# EAGLE design LC_LightCanvas_Rev_1 (EAGLE 7.6.0)
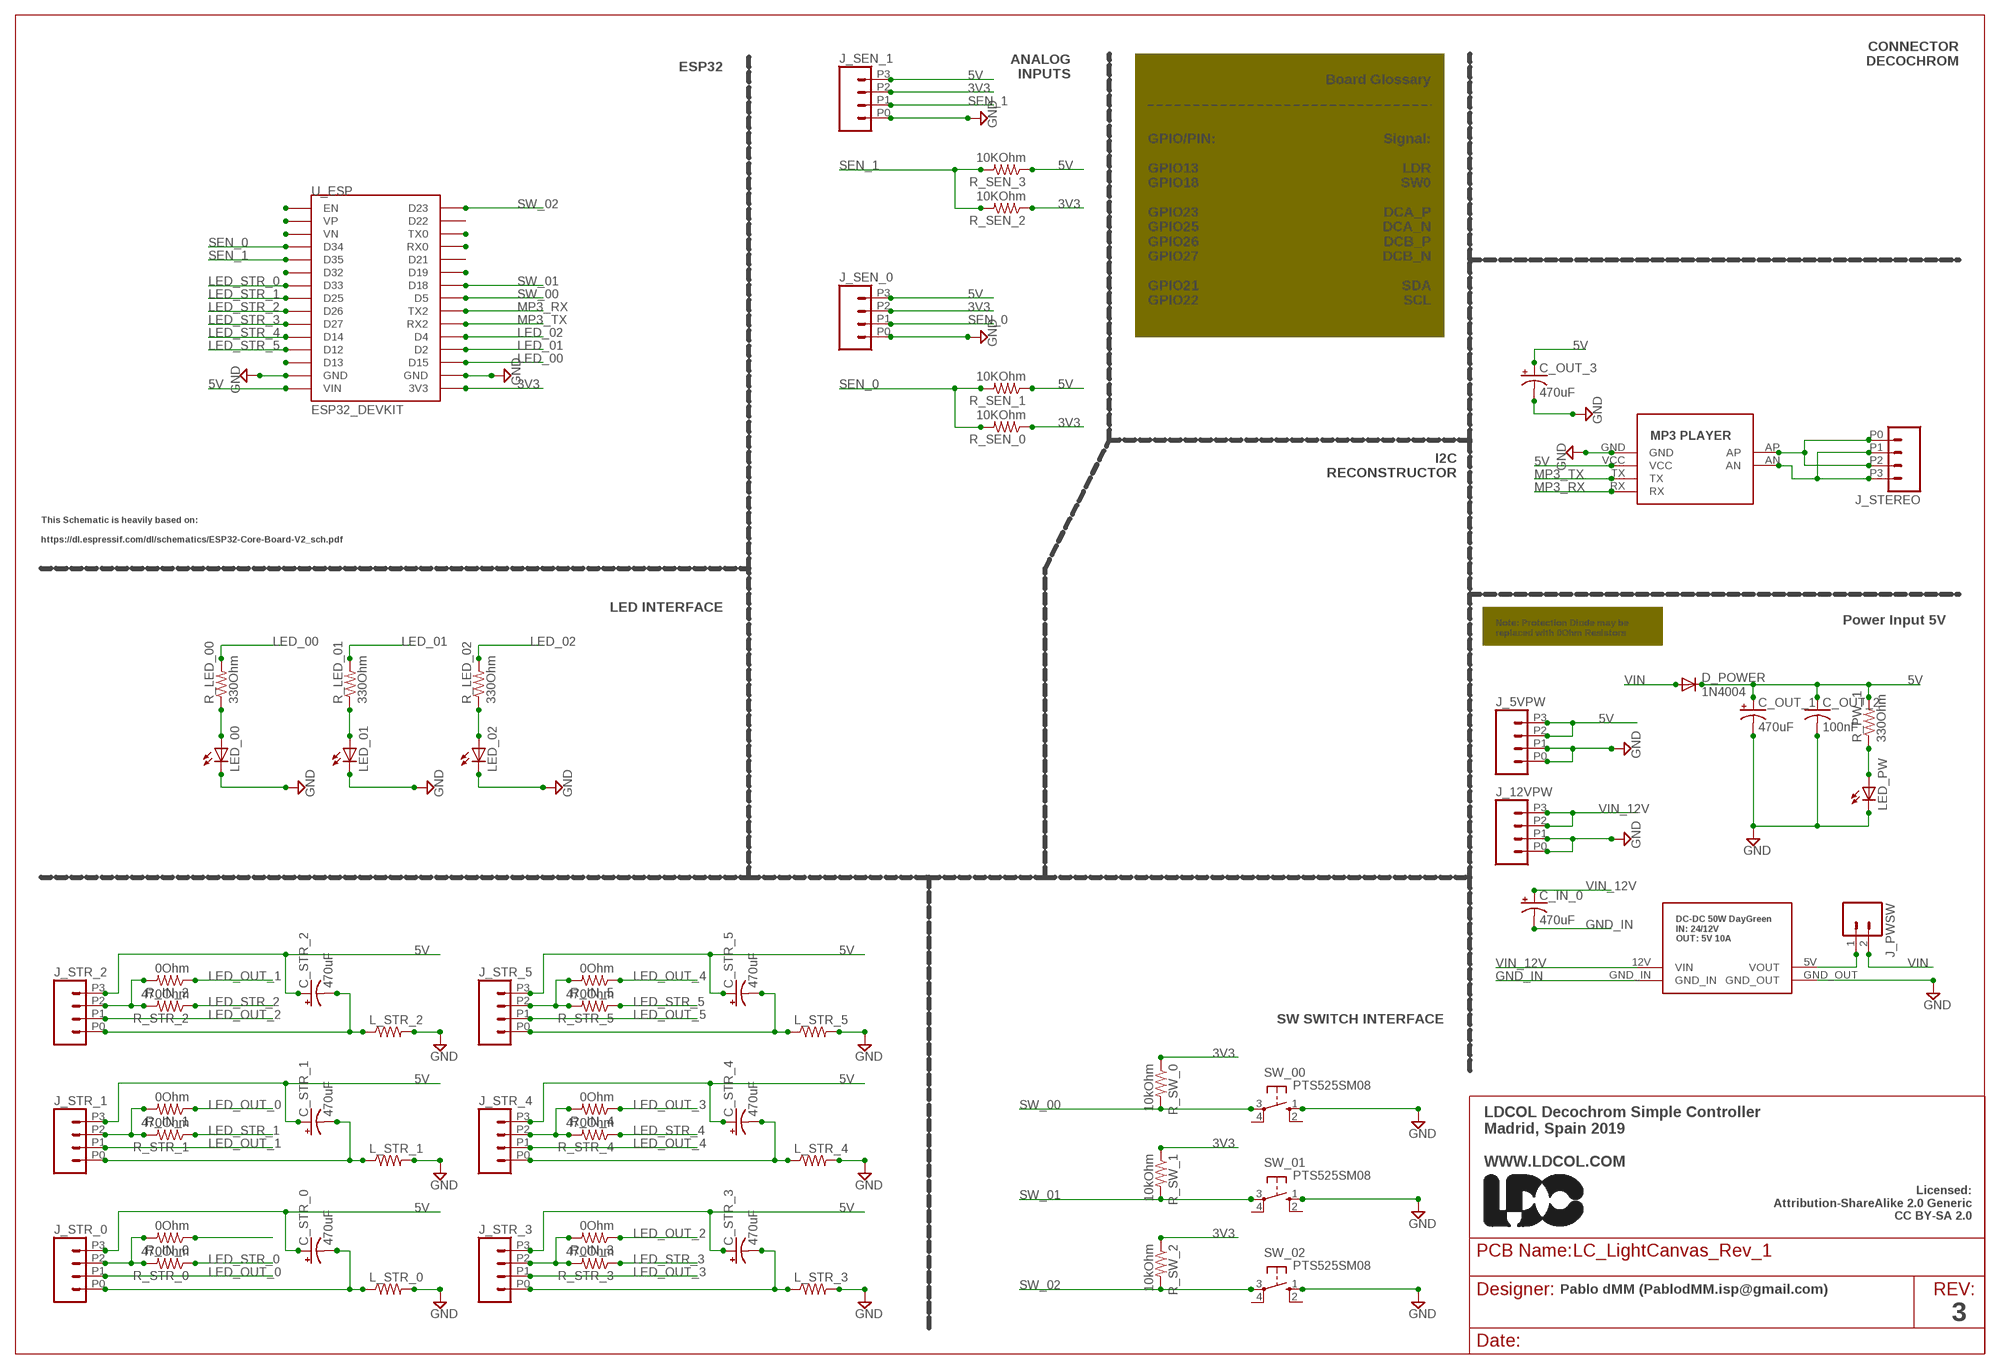
[diagram p0: schematic, sheet 1]

## Parts
C_IN_0  470uF  CPOL-USE5-10.5  [E5-10,5]
C_OUT_1  470uF  CPOL-USE5-10.5  [E5-10,5]
C_OUT_2  100nF  C-USC0805  [C0805]
C_OUT_3  470uF  CPOL-USE5-10.5  [E5-10,5]
C_STR_0  470uF  CPOL-USE5-10.5  [E5-10,5]
C_STR_1  470uF  CPOL-USE5-10.5  [E5-10,5]
C_STR_2  470uF  CPOL-USE5-10.5  [E5-10,5]
C_STR_3  470uF  CPOL-USE5-10.5  [E5-10,5]
C_STR_4  470uF  CPOL-USE5-10.5  [E5-10,5]
C_STR_5  470uF  CPOL-USE5-10.5  [E5-10,5]
D_POWER  1N4004  [DO41-10]
J_5VPW  M04  [1X04_2.54_SCREWTERM]
J_12VPW  M04  [1X04_2.54_SCREWTERM]
J_PWSW  M023.5MM-NO_SILK  [SCREWTERMINAL-3.5MM-2-NS]
J_SEN_0  M04  [1X04_2.54_SCREWTERM]
J_SEN_1  M04  [1X04_2.54_SCREWTERM]
J_STEREO  M04  [1X04_2.54_SCREWTERM]
J_STR_0  M04  [1X04_2.54_SCREWTERM]
J_STR_1  M04  [1X04_2.54_SCREWTERM]
J_STR_2  M04  [1X04_2.54_SCREWTERM]
J_STR_3  M04  [1X04_2.54_SCREWTERM]
J_STR_4  M04  [1X04_2.54_SCREWTERM]
J_STR_5  M04  [1X04_2.54_SCREWTERM]
L_STR_0  R-US_R2012  [R2012]
L_STR_1  R-US_R2012  [R2012]
L_STR_2  R-US_R2012  [R2012]
L_STR_3  R-US_R2012  [R2012]
L_STR_4  R-US_R2012  [R2012]
L_STR_5  R-US_R2012  [R2012]
LED_00  LEDCHIPLED_0805  [CHIPLED_0805]
LED_01  LEDCHIPLED_0805  [CHIPLED_0805]
LED_02  LEDCHIPLED_0805  [CHIPLED_0805]
LED_PW  LEDCHIPLED_0805  [CHIPLED_0805]
R_IN_0  0Ohm  R-US_M0805  [M0805]
R_IN_1  0Ohm  R-US_M0805  [M0805]
R_IN_2  0Ohm  R-US_M0805  [M0805]
R_IN_3  0Ohm  R-US_M0805  [M0805]
R_IN_4  0Ohm  R-US_M0805  [M0805]
R_IN_5  0Ohm  R-US_M0805  [M0805]
R_LED_00  330Ohm  R-US_M0805  [M0805]
R_LED_01  330Ohm  R-US_M0805  [M0805]
R_LED_02  330Ohm  R-US_M0805  [M0805]
R_PW_1  330Ohm  R-US_M0805  [M0805]
R_SEN_0  10KOhm  R-US_M1206  [M1206]
R_SEN_1  10KOhm  R-US_M1206  [M1206]
R_SEN_2  10KOhm  R-US_M1206  [M1206]
R_SEN_3  10KOhm  R-US_M1206  [M1206]
R_STR_0  470Ohm  R-US_M0805  [M0805]
R_STR_1  470Ohm  R-US_M0805  [M0805]
R_STR_2  470Ohm  R-US_M0805  [M0805]
R_STR_3  470Ohm  R-US_M0805  [M0805]
R_STR_4  470Ohm  R-US_M0805  [M0805]
R_STR_5  470Ohm  R-US_M0805  [M0805]
R_SW_0  10kOhm  R-US_M0805  [M0805]
R_SW_1  10kOhm  R-US_M0805  [M0805]
R_SW_2  10kOhm  R-US_M0805  [M0805]
SW_00  PTS525SM08  [SM08]
SW_01  PTS525SM08  [SM08]
SW_02  PTS525SM08  [SM08]
U$1  DC_CONVERTER  [DC_CONVERTER]
U$2  MP3_PLAYER  [MP3_PLAYER]
U_ESP  ESP32_DEVKIT  [ESP32_DEVKIT]

## Nets
3V3: J_SEN_0.P2 J_SEN_1.P2 R_SEN_0.1 R_SEN_2.1 R_SW_0.1 R_SW_1.1 R_SW_2.1 U_ESP.3V3
5V [GND]: C_OUT_1.+ C_OUT_2.1 C_OUT_3.+ C_STR_0.+ C_STR_1.+ C_STR_2.+ C_STR_3.+ C_STR_4.+ C_STR_5.+ D_POWER.C J_5VPW.P2 J_5VPW.P3 J_SEN_0.P3 J_SEN_1.P3 J_STR_0.P3 J_STR_1.P3 J_STR_2.P3 J_STR_3.P3 J_STR_4.P3 J_STR_5.P3 R_PW_1.2 R_SEN_1.1 R_SEN_3.1 U$2.VCC U_ESP.VIN
GND [GND]: C_OUT_1.- C_OUT_2.2 C_OUT_3.- J_5VPW.P0 J_5VPW.P1 J_12VPW.P0 J_12VPW.P1 J_SEN_0.P0 J_SEN_1.P0 L_STR_0.2 L_STR_1.2 L_STR_2.2 L_STR_3.2 L_STR_4.2 L_STR_5.2 LED_00.C LED_01.C LED_02.C LED_PW.C SW_00.1(S) SW_01.1(S) SW_02.1(S) U$1.GND_OUT U$2.GND U_ESP.GND@1(GND) U_ESP.GND@2(GND)
GND_IN: C_IN_0.- U$1.GND_IN
LED_00: R_LED_00.2 U_ESP.D15
LED_01: R_LED_01.2 U_ESP.D2
LED_02: R_LED_02.2 U_ESP.D4
LED_OUT_0: J_STR_0.P1 R_IN_1.1
LED_OUT_1: J_STR_1.P1 R_IN_2.1
LED_OUT_2: J_STR_2.P1 R_IN_3.1
LED_OUT_3: J_STR_3.P1 R_IN_4.1
LED_OUT_4: J_STR_4.P1 R_IN_5.1
LED_OUT_5: J_STR_5.P1
LED_STR_0: R_STR_0.1 U_ESP.D33
LED_STR_1: R_STR_1.1 U_ESP.D25
LED_STR_2: R_STR_2.1 U_ESP.D26
LED_STR_3: R_STR_3.1 U_ESP.D27
LED_STR_4: R_STR_4.1 U_ESP.D14
LED_STR_5: R_STR_5.1 U_ESP.D12
MP3_RX: U$2.RX U_ESP.TX2
MP3_TX: U$2.TX U_ESP.RX2
N$1: LED_01.A R_LED_01.1
N$2: LED_02.A R_LED_02.1
N$3: C_STR_0.- J_STR_0.P0 L_STR_0.1
N$4: R_IN_0.1
N$5: C_STR_1.- J_STR_1.P0 L_STR_1.1
N$6: J_STR_1.P2 R_IN_1.2 R_STR_1.2
N$7: U_ESP.D13
N$8: LED_00.A R_LED_00.1
N$9: J_PWSW.1 U$1.5V(VOUT)
N$10: LED_PW.A R_PW_1.1
N$11: J_STR_0.P2 R_IN_0.2 R_STR_0.2
N$12: U_ESP.D32
N$13: C_STR_3.- J_STR_3.P0 L_STR_3.1
N$14: U_ESP.D19
N$15: U_ESP.VN
N$16: U_ESP.VP
N$17: U_ESP.EN
N$18: U_ESP.TX0
N$19: U_ESP.RX0
N$20: C_STR_2.- J_STR_2.P0 L_STR_2.1
N$21: J_STR_2.P2 R_IN_2.2 R_STR_2.2
N$24: J_STR_3.P2 R_IN_3.2 R_STR_3.2
N$26: C_STR_4.- J_STR_4.P0 L_STR_4.1
N$27: J_STR_4.P2 R_IN_4.2 R_STR_4.2
N$28: C_STR_5.- J_STR_5.P0 L_STR_5.1
N$29: J_STR_5.P2 R_IN_5.2 R_STR_5.2
N$32: J_STEREO.P0 J_STEREO.P2 U$2.AP
N$33: J_STEREO.P1 J_STEREO.P3 U$2.AN
SEN_0: J_SEN_0.P1 R_SEN_0.2 R_SEN_1.2 U_ESP.D34
SEN_1: J_SEN_1.P1 R_SEN_2.2 R_SEN_3.2 U_ESP.D35
SW_00: R_SW_0.2 SW_00.3(P) U_ESP.D5
SW_01: R_SW_1.2 SW_01.3(P) U_ESP.D18
SW_02: R_SW_2.2 SW_02.3(P) U_ESP.D23
VIN: D_POWER.A J_PWSW.2
VIN_12V: C_IN_0.+ J_12VPW.P2 J_12VPW.P3 U$1.12V(VIN)
Unconnected: SW_00.2(S) SW_00.4(P) SW_01.2(S) SW_01.4(P) SW_02.2(S) SW_02.4(P) U_ESP.D21 U_ESP.D22

## Notes on the sheet
- CONNECTOR
  DECOCHROM
- ESP32
- ANALOG
  INPUTS
- Board Glossary
- GPIO/PIN:
  
  GPIO13
  GPIO18
  
  GPIO23
  GPIO25
  GPIO26
  GPIO27
  
  GPIO21
  GPIO22
- Signal:
  
  LDR
  SW0
  
  DCA_P
  DCA_N
  DCB_P
  DCB_N
  
  SDA
  SCL
- I2C
  RECONSTRUCTOR
- This Schematic is heavily based on:
  
  https://dl.espressif.com/dl/schematics/ESP32-Core-Board-V2_sch.pdf
- LED INTERFACE
- Note: Protection Diode may be
  replaced with 0Ohm Resistors
- Power Input 5V
- SW SWITCH INTERFACE
- LDCOL Decochrom Simple Controller
  Madrid, Spain 2019
  
  WWW.LDCOL.COM
- Licensed:
  Attribution-ShareAlike 2.0 Generic
  CC BY-SA 2.0
- Pablo dMM (PablodMM.isp@gmail.com)
- 3

## Library data of the parts
C_IN_0 C_OUT_1 C_OUT_3 C_STR_0 C_STR_1-C_STR_5 = adafruit:CPOL-US: POLARIZED CAPACITOR, American symbol
C_OUT_2 = adafruit:C-US: CAPACITOR, American symbol
D_POWER = adafruit:1N4004: DIODE General purpose 1N400x type rectifier (With bigger pads) http://www.ladyada.net/library/pcb/eaglelibrary.html
J_5VPW J_12VPW J_SEN_0 J_SEN_1 J_STEREO J_STR_0 J_STR_1-J_STR_5 = SparkFun-Connectors2:M04: Header 4 Standard 4-pin 0.1" header. Use with straight break away headers (SKU : PRT-00116), right angle break away headers (PRT-00553), swiss pins (PRT-00743), machine pins (PRT-00117), and female headers (PRT-00115). Molex polarized connector foot print use with SKU : PRT-08231 with associated crimp pins and housings. 1MM SMD Version SKU: PRT-10208
J_PWSW = SparkFun-Connectors:M02: Standard 2-pin 0.1" header. Use with - straight break away headers ( PRT-00116) - right angle break away headers (PRT-00553) - swiss pins (PRT-00743) - machine pins (PRT-00117) - female headers (PRT-00115) Molex polarized connector foot print use with: PRT-08233 with associated crimp pins and housings. 2.54_SCREWTERM for use with PRT-10571. 3.5mm Screw Terminal footprints for PRT-08084 5mm Screw Terminal footprints for use with PRT-08432; PROD_ID: CONN-08399
L_STR_0 L_STR_1-L_STR_5 R_IN_0 R_IN_1-R_IN_5 R_LED_00 R_LED_01 R_LED_02 R_PW_1 R_SEN_0 R_SEN_1-R_SEN_3 R_STR_0 R_STR_1-R_STR_5 R_SW_0 R_SW_1 R_SW_2 = adafruit:R-US_: RESISTOR, American symbol
LED_00 LED_01 LED_02 LED_PW = adafruit:LED: LED OSRAM: - CHIPLED LG R971, LG N971, LY N971, LG Q971, LY Q971, LO R971, LY R971 LH N974, LH R974 LS Q976, LO Q976, LY Q976 LO Q996 - Hyper CHIPLED LW Q18S LB Q993, LB Q99A, LB R99A - SideLED LS A670, LO A670, LY A670, LG A670, LP A670 LB A673, LV A673, LT A673, LW A673 LH A674 LY A675 LS A676, LA A676, LO A676, LY A676, LW A676 LS A679, LY A679, LG A679 - Hyper Micro SIDELED® LS Y876, LA Y876, LO Y876, LY Y876 LT Y87S - SmartLED LW L88C, LW L88S LB L89C, LB L89S, LG L890 LS L89K, LO L89K, LY L89K LS L896, LA L896, LO L896, LY L896 - TOPLED LS T670, LO T670, LY T670, LG T670, LP T670 LSG T670, LSP T670, LSY T670, LOP T670, LYG T670 LG T671, LOG T671, LSG T671 LB T673, LV T673, LT T673, LW T673 LH T674 LS T676, LA T676, LO T676, LY T676, LB T676, LH T676, LSB T676, LW T676 LB T67C, LV T67C, LT T67C, LS T67K, LO T67K, LY T67K, LW E67C LS E67B, LA E67B, LO E67B, LY E67B, LB E67C, LV E67C, LT E67C LW T67C LS T679, LY T679, LG T679 LS T770, LO T770, LY T770, LG T770, LP T770 LB T773, LV T773, LT T773, LW T773 LH T774 LS E675, LA E675, LY E675, LS T675 LS T776, LA T776, LO T776, LY T776, LB T776 LHGB T686 LT T68C, LB T68C - Hyper Mini TOPLED® LB M676 - Mini TOPLED Santana® LG M470 LS M47K, LO M47K, LY M47K Source: http://www.osram.convergy.de/
SW_00 SW_01 SW_02 = pts525_20:PTS525*: PTS 525 Series Miniature Tact Switch for SMD Source: http://www.ck-components.com/14407/pts525_8sept14.pdf/; MF: C&K Components; MPN: PTS525SM08SMTR2LFS; OC_FARNELL: unknown; OC_NEWARK: unknown
U$1 = ART_Collage:DC_CONVERTER
U$2 = ART_Collage:MP3_PLAYER
U_ESP = DOIT_ESP32_DEVKIT:ESP32_DEVKIT: ESP32 DEVKIT BOARD

## Net classes
1 GND: width 1.27 mm, clearance 0.305 mm
2 VCC: width 1.27 mm, clearance 0.305 mm to class 1

## Board
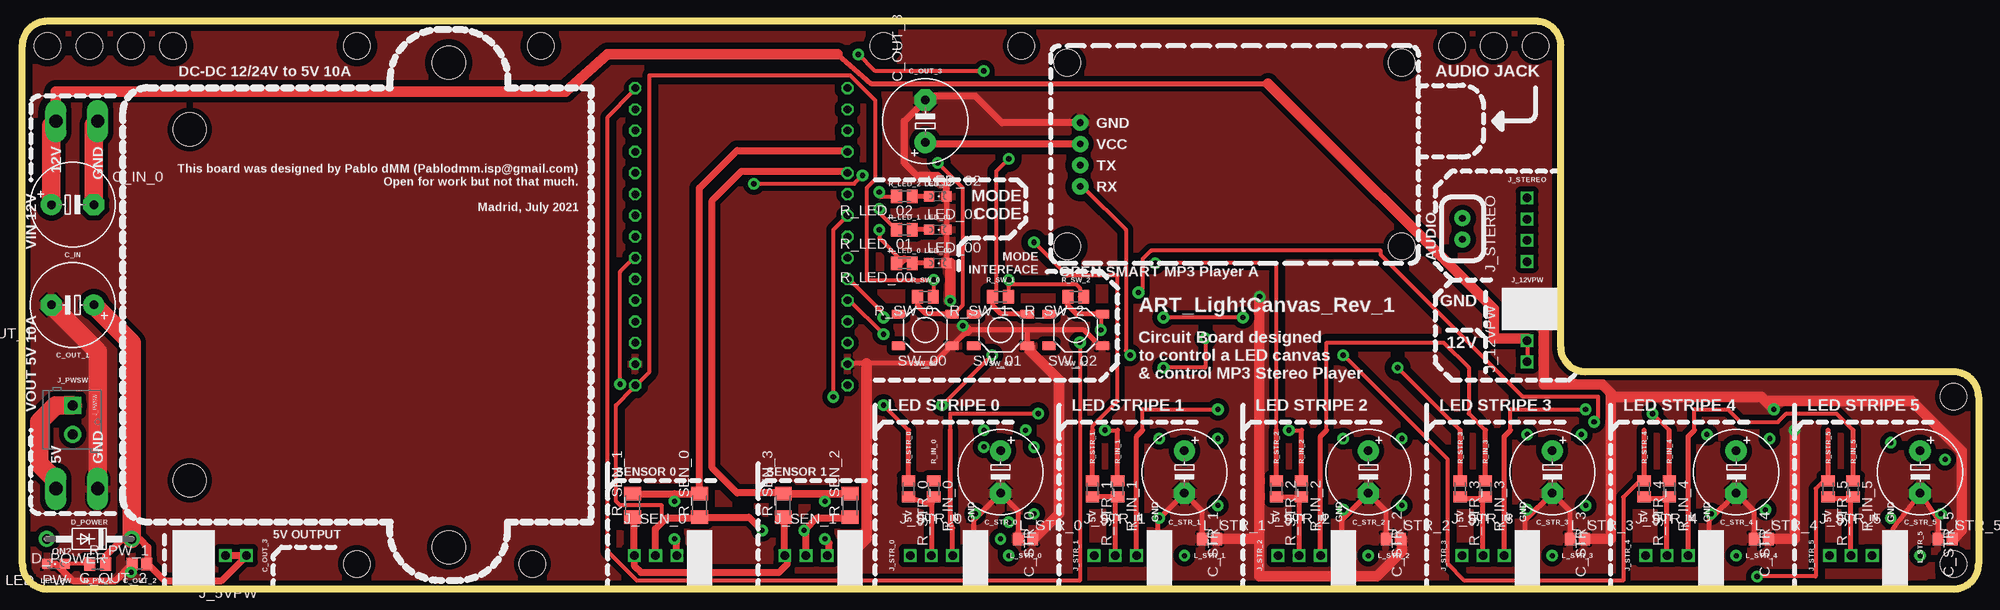
[diagram p1: board, top side]
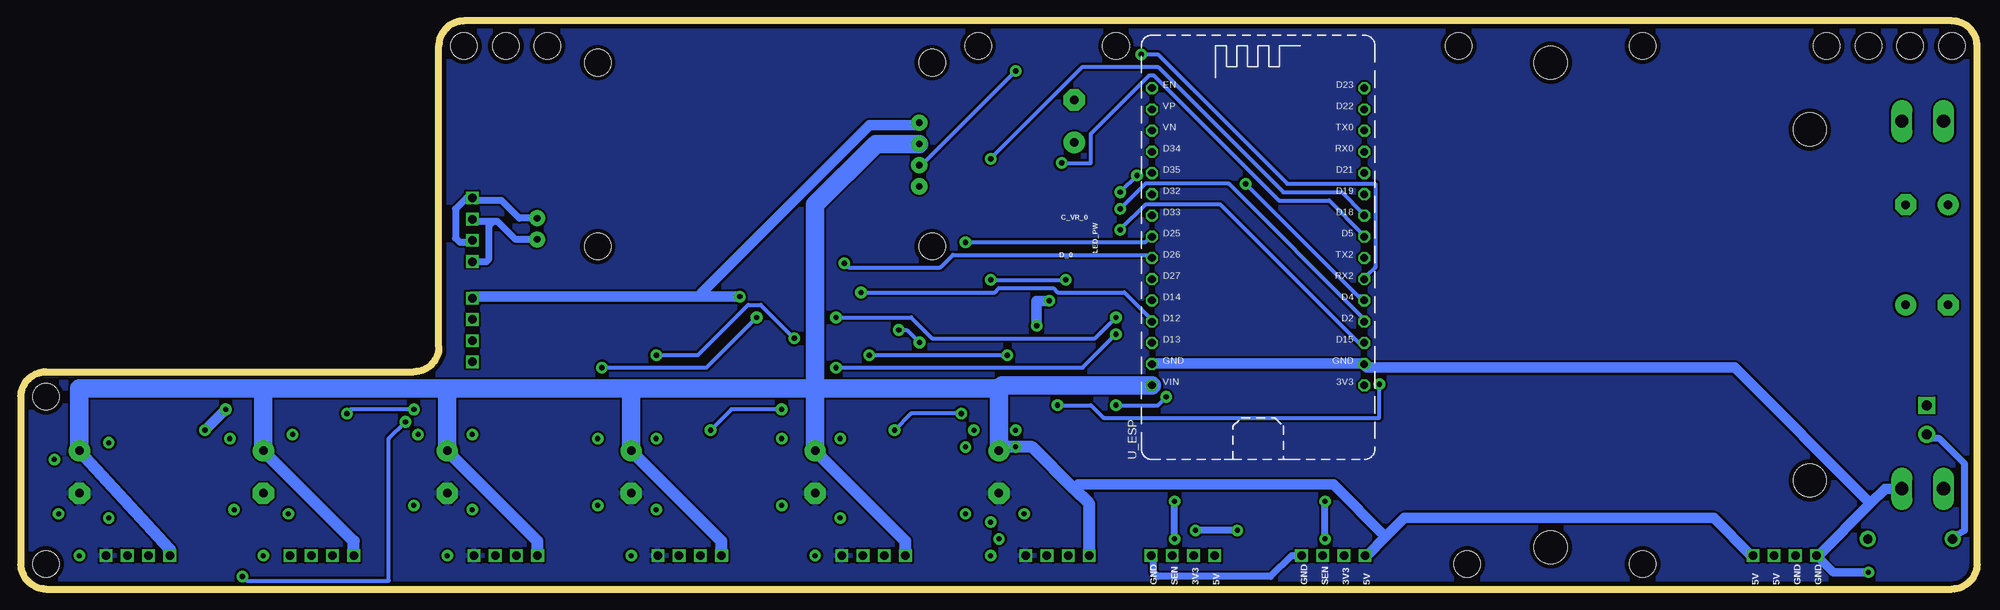
[diagram p2: board, bottom side, seen from below]

Size 234 x 68 mm. Coordinates in mm from the lower left corner, seen from the top.
Outline: 0,3 0,65 arc-90 3,68 181,68 arc-90 184,65 184,29 arc90 187,26 231,26 arc-90 234,23 234,3 arc-90 231,0 3,0 arc-90 0,3
Copper layers (1*16): Top 0.035mm / dielectric 1.5mm / Bottom 0.035mm
Design rules "default *": minimum track width 20mil, minimum drill 25mil, track to track 10mil, track to pad 10mil, pad to pad 10mil, via to via 10mil, smd to smd 8mil, copper to edge 20mil, drill to drill 8mil, minimum pad ring 10mil, minimum via ring 15mil, stop-mask expansion 4mil, vias tented up to drill 0mil, thermal gap 10mil
Holes 3.2 mm at 3,65 8,65 13,65 18,65 181,65 176,65 171,65 231,23 231,3 62,65 40,65 40,3 61,3 119.5,65 103,65

### Footprints (pad centres in the part's own frame; a part is rotated, then mirrored left to right if it is on the bottom)
E5-10,5 = drill 1.016 pad 2.54: + -2.54,0 | drill 1.016 pad 2.54 octagon: - 2.54,0
C0805 = smd 1.3 x 1.5: 1 -0.85,0; 2 0.85,0
DO41-10 = drill 1.118 pad 1.93: A 5.08,0; C -5.08,0
1X04_2.54_SCREWTERM = drill 1.016 square: P0 3.81,0; P1 1.27,0; P2 -1.27,0; P3 -3.81,0
SCREWTERMINAL-3.5MM-2-NS = drill 1.2 pad 2.032 square: 1 0,0 | drill 1.2 pad 2.032: 2 3.5,0
R2012 = smd 1.3 x 1.5: 1 -0.85,0; 2 0.85,0
CHIPLED_0805 = smd 1.2 x 1.2: A 0,-1.05; C 0,1.05
M0805 = smd 1.3 x 1.6: 1 -0.95,0; 2 0.95,0
M1206 = smd 1.6 x 2: 1 -1.4,0; 2 1.4,0
SM08 = smd 1.6 x 1: 1 -3.2,1.9; 2 3.2,1.9; 3 -3.2,-1.9; 4 3.2,-1.9
DC_CONVERTER = drill 1.6 pad 2.54 long: 5V -22,63; 12V 22,63; GND_IN 22,58; GND_OUT -22,58 | hole 4: 29,16; -29,16; -21,47; 21,47
MP3_PLAYER = drill 0.8 pad 1.93: AN 10.16,48.26; AP 7.62,48.26; GND -3.81,2.54; RX 3.81,2.54; TX 1.27,2.54; VCC -1.27,2.54 | hole 3.2: -11,1; 11,1; -11,41; 11,41
ESP32_DEVKIT = drill 0.9 pad 1.422 octagon: 3V3 12.7,8.89; D2 12.7,16.51; D4 12.7,19.05; D5 12.7,26.67; D12 -12.7,16.51; D13 -12.7,13.97; D14 -12.7,19.05; D15 12.7,13.97; D18 12.7,29.21; D19 12.7,31.75; D21 12.7,34.29; D22 12.7,41.91; D23 12.7,44.45; D25 -12.7,26.67; D26 -12.7,24.13; D27 -12.7,21.59; D32 -12.7,31.75; D33 -12.7,29.21; D34 -12.7,36.83; D35 -12.7,34.29; EN -12.7,44.45; GND@1 -12.7,11.43; GND@2 12.7,11.43; RX0 12.7,36.83; RX2 12.7,21.59; TX0 12.7,39.37; TX2 12.7,24.13; VIN -12.7,8.89; VN -12.7,39.37; VP -12.7,41.91

### Placement (x,y rotation side)
C_IN_0  6,46 0 top
C_OUT_1  6,34 180 top
C_OUT_2  14,3 180 top
C_OUT_3  108,56 90 top
C_STR_0  117,14 270 top
C_STR_1  139,14 270 top
C_STR_2  161,14 270 top
C_STR_3  183,14 270 top
C_STR_4  205,14 270 top
C_STR_5  227,14 270 top
D_POWER  8,6 180 top
J_5VPW  23,4 180 top
J_12VPW  180,31 90 top
J_PWSW  6,22 270 top
J_SEN_0  77,4 0 top
J_SEN_1  95,4 0 top
J_STEREO  180,43 90 top
J_STR_0  110,4 0 top
J_STR_1  132,4 0 top
J_STR_2  154,4 0 top
J_STR_3  176,4 0 top
J_STR_4  198,4 0 top
J_STR_5  220,4 0 top
L_STR_0  120,6 0 top
L_STR_1  142,6 0 top
L_STR_2  164,6 0 top
L_STR_3  186,6 0 top
L_STR_4  208,6 0 top
L_STR_5  230,6 0 top
LED_00  109.5,39 270 top
LED_01  109.5,43 270 top
LED_02  109.5,47 270 top
LED_PW  4,3 90 top
R_IN_0  109,12 270 top
R_IN_1  131,12 270 top
R_IN_2  153,12 270 top
R_IN_3  175,12 270 top
R_IN_4  197,12 270 top
R_IN_5  219,12 270 top
R_LED_00  105.5,39 180 top
R_LED_01  105.5,43 180 top
R_LED_02  105.5,47 180 top
R_PW_1  9,3 0 top
R_SEN_0  81,10 90 top
R_SEN_1  73,10 90 top
R_SEN_2  99,10 90 top
R_SEN_3  91,10 90 top
R_STR_0  106,12 270 top
R_STR_1  128,12 270 top
R_STR_2  150,12 270 top
R_STR_3  172,12 270 top
R_STR_4  194,12 270 top
R_STR_5  216,12 270 top
R_SW_0  108,35 180 top
R_SW_1  117,35 180 top
R_SW_2  126,35 180 top
SW_00  108,31 180 top
SW_01  117,31 180 top
SW_02  126,31 180 top
U$1  67,34 90 top
U$2  124,52 270 top
U_ESP  86,15.5 0 bottom

### Tracks (layer width: path | path; a pad name or v marks a point on that pad's centre or on a via)
3V3  (via drill 0.6, 0.64)
  Top 0.508: 118,36.5 118,35 R_SW_1.1 | R_SW_0.1 109,35 v109,37 101,37 101,48 102,49 102,58.5 99,61.5 75,61.5 75,26 73.5,24.5 U_ESP.3V3 73,24 71,22 71,10.5 71.5,10 76.5,10 76.5,8.5 76.75,8.25 | 118,36.5 126,36.5 126.5,36 126.5,35 R_SW_2.1 | 118,36.5 v118,37
  Top 0.813: J_SEN_1.P2 93.73,7 | 93.73,7 93.73,7.23 95,8.5 98.9,8.5 R_SEN_2.1 | J_SEN_0.P2 75.73,7.23 76.75,8.25 77,8.5 80.9,8.5 R_SEN_0.1 86.9,8.6 v88.5,7 | v93.5,7 93.73,7
  Bottom 0.508: v118,37 v109,37
  Bottom 0.813: v88.5,7 v93.5,7
5V  (via drill 0.6)
  Top 0.813: U$2.VCC 108.19,53.27 C_OUT_3.+ | R_PW_1.2 9.95,3.95 12,6 D_POWER.C 14,6 15,5 15,3.15 C_OUT_2.1 15,3 17,1 23.81,1 J_5VPW.P3 J_5VPW.P2 | R_SEN_1.1 73.19,8.41 J_SEN_0.P3 73.19,2.81 74,2 90.5,2 91.5,3 91.5,3.69 J_SEN_1.P3 91.19,8.41 R_SEN_3.1
  Top 2.184: D_POWER.C 13.08,29.46 C_OUT_1.+
  Bottom 1.016: 116.54,17 C_STR_0.+
  Bottom 1.27: 70.75,6.25 68.5,8.5 31.5,8.5 27,4 J_5VPW.P3 | 70.75,6.25 73,4 J_SEN_0.P3 | 70.75,6.25 77,12.5 107.5,12.5 108,12
  Bottom 1.422: J_STR_0.P3 106.19,10.19 108,12 113,17 v115,17 116.54,17 | J_STR_2.P3 150.19,5.73 C_STR_2.+ | J_STR_3.P3 172.19,5.73 C_STR_3.+ | J_STR_4.P3 194.19,5.73 C_STR_4.+ | J_STR_5.P3 216.19,4.73 C_STR_5.+ | J_STR_1.P3 128.19,5.73 C_STR_1.+
  Bottom 2.184: C_STR_4.+ 205,24 | 205,24 227,24 C_STR_5.+ | C_STR_3.+ 183,24 | 183,24 205,24 | C_STR_2.+ 161,24 | 161,24 183,24 | C_STR_1.+ 139,24 | 139,24 161,24 | C_STR_0.+ 117,24 | 117,24 139,24 | U$2.VCC 131.73,53.27 139,46 139,24 | U_ESP.VIN 116.61,24.39 117,24
GND  (via drill 0.6, 0.64)
  Top 0.61: LED_02.C LED_01.C LED_00.C | SW_02.1 128.9,29.1 127,31 120,31 | 120,31 113.1,31 113.05,30.95 SW_00.1 111.1,29.1 109,27 101,27 98.77,27 U_ESP.GND@1 | SW_01.1 120.2,30.8 120,31 | C_OUT_2.2 13.15,2.15 v13,2
  Top 0.813: U$2.GND 117.19,55.81 114,59 108.46,59 C_OUT_3.- 107.5,58.04 107.5,58 105.5,56 105.5,51 107,49.5 109.5,49.5 110.55,48.45 LED_02.C | LED_PW.C 4,3 6,1 11.15,1 C_OUT_2.2
  Top 1.27: J_5VPW.P1 J_5VPW.P0 | L_STR_0.2 121,6 124,9 124,25 120.5,28.5 120.5,29 SW_01.1 | 101,27 101,6 99,4 J_SEN_1.P0 | 148,6 L_STR_1.2 | v148,35 148,6 | 148,6 148,1.5 162,1.5 165,4.5 165,6 L_STR_2.2 | L_STR_3.2 190,6 190,23 | 190,23 190,23.5 189,24.5 182,24.5 182,32.5 180.75,33.75 | 180.75,33.75 180,34.5 J_12VPW.P0 | L_STR_4.2 212,6 v212,19 | 208.75,22.25 208,23 190,23 | 208.75,22.25 v209.5,21.5 | L_STR_5.2 231,6 232,7 232,16.5 226,22.5 209,22.5 208.75,22.25 | J_12VPW.P1 180,32.5 180.5,33 180.5,33.5 180.75,33.75 | v112.5,31.5 113.05,30.95 | v111,34.5 111,39 LED_00.C
  Top 2.184: U$1.GND_OUT 9,28.46 C_OUT_1.-
  Bottom 0.813: J_SEN_0.P0 82,4 84.5,1.5 98,1.5 98.5,2 98.5,3.69 J_SEN_1.P0
  Bottom 1.016: v13,2 17.19,2 J_5VPW.P0
  Bottom 1.27: 12.75,10.25 11,12 U$1.GND_OUT | 12.75,10.25 19,4 J_5VPW.P0 | U_ESP.GND@1 98.5,27 73.5,27 U_ESP.GND@2 73,26.5 29,26.5 12.75,10.25 | 152.5,35 180,35 J_12VPW.P0 | 152.5,35 v148,35 | v209.5,21.5 v212,19 | U$2.GND 127,55.5 132.5,55.5 152.5,35.5 152.5,35 | v112.5,31.5 112.5,34.5 v111,34.5
  pour Top (isolate 0.61): 3,0 231,0 arc90 234,3 234,23 arc90 231,26 187,26 arc-90 184,29 184,65 arc90 181,68 3,68 arc90 0,65 0,3 arc90
GND_IN
  Top 2.184: C_IN_0.- 8.54,55.54 U$1.GND_IN
LED_00  (via drill 0.64)
  Top 0.508: v102.5,43 102.5,42 105,39.5 R_LED_00.2
  Top 0.813: R_LED_00.2 105,39 105.5,39.5
  Bottom 0.508: v102.5,43 99.5,46 90.5,46 74,29.5 73.5,29.5 U_ESP.D15
LED_01  (via drill 0.64)
  Top 0.508: v102.5,45.5 102.5,45 104.5,43 R_LED_01.2
  Bottom 0.508: v102.5,45.5 99.5,48.5 89.5,48.5 73.5,32.5 U_ESP.D2
LED_02  (via drill 0.64)
  Top 0.508: R_LED_02.2 102.5,47 v102.5,47.5 | v100.5,49.5 99.5,48.5 v87.5,48.5
  Bottom 0.508: v100.5,49.5 v102.5,47.5 | v87.5,48.5 74,35 73.5,35 U_ESP.D4
LED_OUT_0  (via drill 0.64)
  Top 0.508: v129.5,19 131,19 | v121.5,21 111,21 111,19
  Top 0.61: J_STR_0.P1 111.27,7.27 111,8 111,19 | R_IN_1.1 131,19
  Bottom 0.508: v129.5,19 127.5,21 v121.5,21
LED_OUT_1  (via drill 0.64)
  Top 0.508: v151.5,19 153,19 | v143,21.5 134,21.5 134,19
  Top 0.61: J_STR_1.P1 133.27,18.27 134,19 | R_IN_2.1 153,19
  Bottom 0.508: v151.5,19 149,21.5 v143,21.5
LED_OUT_2
  Top 0.508: 175,19 173,21 173,26.5 170,29.5 156,29.5 156,19
  Top 0.61: J_STR_2.P1 155.27,18.27 156,19 | R_IN_3.1 175,19
LED_OUT_3  (via drill 0.64)
  Top 0.508: v195,21 197,19 | v187,21.5 178,21.5 178,19
  Top 0.61: J_STR_3.P1 177.27,18.27 178,19 | R_IN_4.1 197,19
  Bottom 0.508: v195,21 194.5,21.5 v187,21.5
LED_OUT_4
  Top 0.508: 219,19 217,21 211,21 210,20 205.5,20 204,21.5 200,21.5 200,19
  Top 0.61: J_STR_4.P1 199.27,18.27 200,19 | R_IN_5.1 219,19
LED_STR_0  (via drill 0.64)
  Top 0.508: v97,23 97,43 98.5,44.5 U_ESP.D33 | 106,19 v103,22
  Top 0.61: R_STR_0.1 106,19
  Bottom 0.508: v97,23 98,22 v103,22
LED_STR_1  (via drill 0.64)
  Top 0.508: v121,41.5 125,37.5 131,37.5 131,22.5 128,19.5 128,19
  Top 0.61: R_STR_1.1 128,19
  Bottom 0.508: v121,41.5 99.5,41.5 99,42 U_ESP.D25
LED_STR_2  (via drill 0.64)
  Top 0.508: v135.5,39 150,39 150,19
  Top 0.61: R_STR_2.1 150,19
  Bottom 0.508: v135.5,39 135,38.5 124,38.5 122.5,40 99,40 U_ESP.D26
LED_STR_3  (via drill 0.64)
  Top 0.508: v103,32.5 103,33 99,37 U_ESP.D27 | v146,32.5 v136.5,32.5 | 172,19 v164.5,26.5
  Top 0.61: R_STR_3.1 172,19
  Bottom 0.508: v103,32.5 105.5,30 125,30 127.5,32.5 v136.5,32.5 | v146,32.5 152,26.5 v164.5,26.5
LED_STR_4  (via drill 0.64)
  Top 0.508: v103,30.5 99,34.5 U_ESP.D14 | v136.5,26.5 141.5,26.5 v141.5,30 | v158,28 170.5,15.5 170.5,3 172.5,1 191.5,1 191.5,11 194,13.5
  Top 0.61: R_STR_4.1 194,13.5 194,19
  Bottom 0.508: v103,30.5 107,26.5 v136.5,26.5 | v141.5,30 145.5,34 147,34 153,28 v158,28
LED_STR_5  (via drill 0.64)
  Top 0.508: v133.5,35.5 134,36 134,39.5 135,40.5 162.5,40.5 162.5,40 179.5,23 188.5,23 188.5,20.5 v188,20 | v207.5,1.5 214.5,1.5 214.5,12 216,13.5
  Top 0.61: R_STR_5.1 216,13.5 216,19
  Bottom 0.508: v133.5,35.5 117.5,35.5 117,36 110.5,36 110,35.5 102,35.5 99,32.5 U_ESP.D12 | v188,20 190,18 190,1 207,1 v207.5,1.5
MP3_RX  (via drill 0.64)
  Top 0.508: v71.5,24.5 71.5,38 73,39.5 U_ESP.TX2 | v116,28 v110,22 | v132.5,28 132,28.5 132,43 127,48 U$2.RX
  Bottom 0.508: v71.5,24.5 71.5,20.5 104.5,20.5 106,22 v110,22 | v132.5,28 v116,28
MP3_TX  (via drill 0.64)
  Top 0.508: v100,64 102,62 v115,62
  Bottom 0.508: v100,64 98,64 82.5,48.5 72,48.5 72,38.5 73,37.5 U_ESP.RX2 | v115,62 126,51 126.5,51 U$2.TX
N26
  pour Bottom (isolate 0.406): 191,1 209,1 211,3 211,18 208,21 195,21 191,18
N$1
  Top 0.61: LED_01.A R_LED_01.1
N$2
  Top 0.61: LED_02.A R_LED_02.1
N$3
  Top 0.61: J_STR_0.P0 113.81,8.27 C_STR_0.- 119.15,9.31 L_STR_0.1
  pour Top (isolate 0.61): 113,18 113,2 114,1 119,7 120,8 122,8 122,18 120,20 115,20
  pour Bottom (isolate 0.406): 103,1 121,1 123,3 123,18 120,21 107,21 103,18
  pour Bottom (isolate 0.406): 103,1 121,1 123,3 123,18 120,21 107,21 103,18
  pour Top (isolate 0.61): 113,18 113,2 114,1 117,1 119,3 119,7 120,8 122,8 122,18 120,20 115,20
N$5
  Top 0.61: J_STR_1.P0 135.81,8.27 C_STR_1.- 141.15,9.31 L_STR_1.1
  pour Bottom (isolate 0.406): 125,1 143,1 145,3 145,18 142,21 129,21 125,18
  pour Top (isolate 0.61): 135,18 135,2 136,1 139,1 141,3 141,7 142,8 144,8 144,18 142,20 137,20
N$6
  Top 0.61: J_STR_1.P2 130.73,10.78 R_IN_1.2 R_STR_1.2 128,11
N$8
  Top 0.61: LED_00.A R_LED_00.1
N$9
  Top 2.184: U$1.5V 4,13 2,15 2,20 4,22 J_PWSW.1
N$10
  Top 0.508: R_PW_1.1 LED_PW.A
N$11
  Top 0.61: R_IN_0.2 108.73,10.05 | R_STR_0.2 108.73,10.05 | 108.73,10.05 J_STR_0.P2
N$13
  Top 0.61: J_STR_3.P0 179.81,8.27 C_STR_3.- 185.15,9.31 L_STR_3.1
  pour Bottom (isolate 0.406): 169,1 187,1 189,3 189,18 186,21 173,21 169,18
  pour Top (isolate 0.61): 179,18 179,2 180,1 183,1 185,3 185,7 186,8 188,8 188,18 186,20 181,20
N$20
  Top 0.61: J_STR_2.P0 157.81,8.27 C_STR_2.- 163.15,9.31 L_STR_2.1
  pour Top (isolate 0.61): 157,18 157,2 158,1 161,1 163,3 163,7 164,8 166,8 166,18 164,20 159,20
  pour Bottom (isolate 0.406): 147,1 165,1 167,3 167,18 164,21 151,21 147,18
N$21
  Top 0.61: J_STR_2.P2 152.73,10.78 | 152.73,10.78 R_IN_2.2 | 152.73,10.78 152.22,10.78 152,11 150.05,11 R_STR_2.2
N$24
  Top 0.61: J_STR_3.P2 174.73,10.78 | 174.73,10.78 R_IN_3.2 | 174.73,10.78 172.27,10.78 R_STR_3.2
N$25  (via drill 0.6)
  other vias: 115,19
N$26
  Top 0.61: J_STR_4.P0 201.81,8.27 C_STR_4.- 207.15,9.31 L_STR_4.1
  pour Top (isolate 0.61): 201,18 201,2 202,1 205,1 207,3 207,7 208,8 210,8 210,18 208,20 203,20
N$27
  Top 0.61: J_STR_4.P2 196.73,10.78 | 196.73,10.78 R_IN_4.2 | 196.73,10.78 194.27,10.78 R_STR_4.2
N$28
  Top 0.61: J_STR_5.P0 223.81,7.27 C_STR_5.- 229.15,8.31 L_STR_5.1
  pour Top (isolate 0.61): 223,18 223,2 224,1 227,1 229,3 229,7 230,8 232,8 232,18 230,20 225,20
  pour Bottom (isolate 0.406): 213,1 231,1 233,3 233,18 230,21 217,21 213,18
N$29
  Top 0.61: J_STR_5.P2 218.73,10.78 | 218.73,10.78 R_IN_5.2 | 218.73,10.78 216.27,10.78 R_STR_5.2
N$30  (via drill 0.6)
  other vias: 120,19
N$31  (via drill 0.6)
  other vias: 121,17
N$32
  Bottom 0.813: U$2.AP 174.38,44.38 176.5,46.5 179.69,46.5 J_STEREO.P0 180.69,46.81 182,45.5 182,42 181.5,41.5 180.23,41.5 J_STEREO.P2
N$33
  Bottom 0.813: U$2.AN 174.84,41.84 177,44 177.5,44 | 177.5,44 179.73,44 J_STEREO.P1 | J_STEREO.P3 178.31,39.19 178,39.5 178,43.5 177.5,44
N$34  (via drill 0.6)
  other vias: 118,4
N$35  (via drill 0.6)
  other vias: 121,9
N$36  (via drill 0.6)
  other vias: 114,9
N$37  (via drill 0.6)
  other vias: 117,6
N$38  (via drill 0.6)
  other vias: 118,8
N$39  (via drill 0.6)
  other vias: 136,8.5
N$40  (via drill 0.6)
  other vias: 143,10
N$41  (via drill 0.6)
  other vias: 143,18
N$42  (via drill 0.6)
  other vias: 136,18
N$43  (via drill 0.6)
  other vias: 139,4
N$44  (via drill 0.6)
  other vias: 161,4
N$45  (via drill 0.6)
  other vias: 158,9.5
N$46  (via drill 0.6)
  other vias: 165,10
N$47  (via drill 0.6)
  other vias: 158,18
N$48  (via drill 0.6)
  other vias: 165,18
N$49  (via drill 0.6)
  other vias: 183,4
N$50  (via drill 0.6)
  other vias: 180,18.5
N$51  (via drill 0.6)
  other vias: 186.5,18.5
N$52  (via drill 0.6)
  other vias: 187,10
N$53  (via drill 0.6)
  other vias: 180,9.5
N$54  (via drill 0.6)
  other vias: 201.5,18.5
N$55  (via drill 0.6)
  other vias: 209,18
N$56  (via drill 0.6)
  other vias: 208.5,9.5
N$57  (via drill 0.6)
  other vias: 202,9
N$58  (via drill 0.6)
  other vias: 205,4
N$59  (via drill 0.6)
  other vias: 227,4
N$60  (via drill 0.6)
  other vias: 223.5,17.5
N$61  (via drill 0.6)
  other vias: 223.5,8.5
N$62  (via drill 0.6)
  other vias: 229.5,9
N$63  (via drill 0.6)
  other vias: 230,15.5
N$64
  pour Bottom: 0,65 arc-90 3,68 181,68 arc-90 184,65 184,29 arc90 187,26 231,26 arc-90 234,23 234,3 arc-90 231,0 3,0 arc-90 0,3
N$65
  pour Bottom (isolate 0.406): 3,0 231,0 arc90 234,3 234,23 arc90 231,26 187,26 arc-90 184,29 184,65 arc90 181,68 3,68 arc90 0,65 0,3 arc90
N$66
  pour Top (isolate 0.813): 234,3 arc-90 231,0 3,0 arc-90 0,3 0,65 arc-90 3,68 181,68 arc-90 184,65 184,29 arc90 187,26 231,26 arc-90 234,23
SEN_0  (via drill 0.6)
  Top 0.813: R_SEN_1.2 78,11.4 | 78,11.4 R_SEN_0.2 81,48 85.5,52.5 98.53,52.5 U_ESP.D34 | J_SEN_0.P1 78.27,5.73 v78,6 | v78,10.5 78,11.4
  Bottom 0.813: v78,6 v78,10.5
SEN_1  (via drill 0.6)
  Top 0.813: J_SEN_1.P1 96.27,4.27 96.5,4.5 96.5,5.5 v96,6 | R_SEN_3.2 96,11.4 | 96,11.4 R_SEN_2.2 91.1,11.4 91,11.5 85.5,11.5 82.5,14.5 82.5,46.5 86,50 98.49,50 U_ESP.D35 | v96,10.5 96,11.4
  Bottom 0.813: v96,6 v96,10.5
SW_00  (via drill 0.64)
  Top 0.508: v109.5,51 112.5,48 112.5,34 111.5,33 SW_00.3
  Top 0.61: R_SW_0.2 107.05,33.95 108,33 111.1,33 SW_00.3
  Bottom 0.508: v109.5,51 106,51 106,54.5 99,61.5 98.5,61.5 83.5,46.5 77.5,46.5 73.5,42.5 U_ESP.D5
SW_01  (via drill 0.64)
  Top 0.508: v118,51.5 116.5,50 116.5,35 R_SW_1.2
  Top 0.61: R_SW_1.2 116.05,33.95 117,33 120.1,33 SW_01.3
  Bottom 0.508: v118,51.5 107,62.5 98,62.5 83,47.5 76,47.5 73.5,45 U_ESP.D18
SW_02  (via drill 0.64)
  Top 0.508: v126.5,29.5 126.5,1 73.5,1 70,4.5 70,56.5 73,59.5 U_ESP.D23 | v129,31 129,32.5 SW_02.3
  Top 0.61: SW_02.3 126.1,32.9 125,34 125,34.95 R_SW_2.2
  Bottom 0.508: v126.5,29.5 128,31 v129,31
VIN
  Bottom 0.813: D_POWER.A 2.5,6.5 1.5,7 1.5,15 4.5,18 5.5,18 J_PWSW.2
VIN_12V
  Top 0.508: J_12VPW.P3 J_12VPW.P2 180,30
  Top 0.61: 149,60.5 101.5,60.5 97.5,64
  Top 1.27: 180,30 176,30 176,33.5 149,60.5 | 97.5,64 70,64 65,59.5 4,59.5 U$1.12V
  Top 2.184: C_IN_0.+ 3.46,55.46 U$1.12V

### Text on the board
t_Silk: C_OUT_3 | AUDIO JACK | J_STEREO | This board was designed by Pablo dMM (Pablodmm.isp@gmail.com) / Open for work but not that much. / / Madrid, July 2021 | R_LED_2 | LED_02 | MODE / CODE | R_LED_1 | LED_01 | C_IN | R_LED_0 | LED_00 | MODE / INTERFACE | R_SW_0 | R_SW_1 | R_SW_2 | J_12VPW | ART_LightCanvas_Rev_1 | GND | 12V | C_OUT_1 | Circuit Board designed / to control a LED canvas / & control MP3 Stereo Player | SW_00 | SW_01 | SW_02 | J_PWSW | LED STRIPE 0 | LED STRIPE 1 | LED STRIPE 2 | LED STRIPE 3 | LED STRIPE 4 | LED STRIPE 5 | R_STR_0 | R_IN_0 | R_STR_1 | R_IN_1 | R_STR_2 | R_IN_2 | R_STR_3 | R_IN_3 | R_STR_4 | R_IN_4 | R_STR_5 | R_IN_5 | SENSOR 0 | SENSOR 1 | D_POWER | 5V | OUT | IN | GND | C_STR_0 | 5V | OUT | IN | GND | C_STR_1 | 5V | OUT | IN | GND | C_STR_2 | 5V | OUT | IN | GND | C_STR_3 | 5V | OUT | IN | GND | C_STR_4 | 5V | OUT | IN | GND | C_STR_5 | 5V OUTPUT | L_STR_5 | ON? | C_OUT_3 | J_STR_0 | L_STR_0 | J_STR_1 | L_STR_1 | J_STR_2 | L_STR_2 | J_STR_3 | L_STR_3 | J_STR_4 | L_STR_4 | J_STR_5 | LED_PW | R_PW_1 | C_OUT_2
b_Silk: C_VR_0 | LED_PW | D_0 | GND | GND | 5V | 5V | 5V | 3V3 | SEN | GND | 5V | 3V3 | SEN | GND